# EAGLE schematic interconnect_RA_V1.2 (EAGLE 9.3.0)
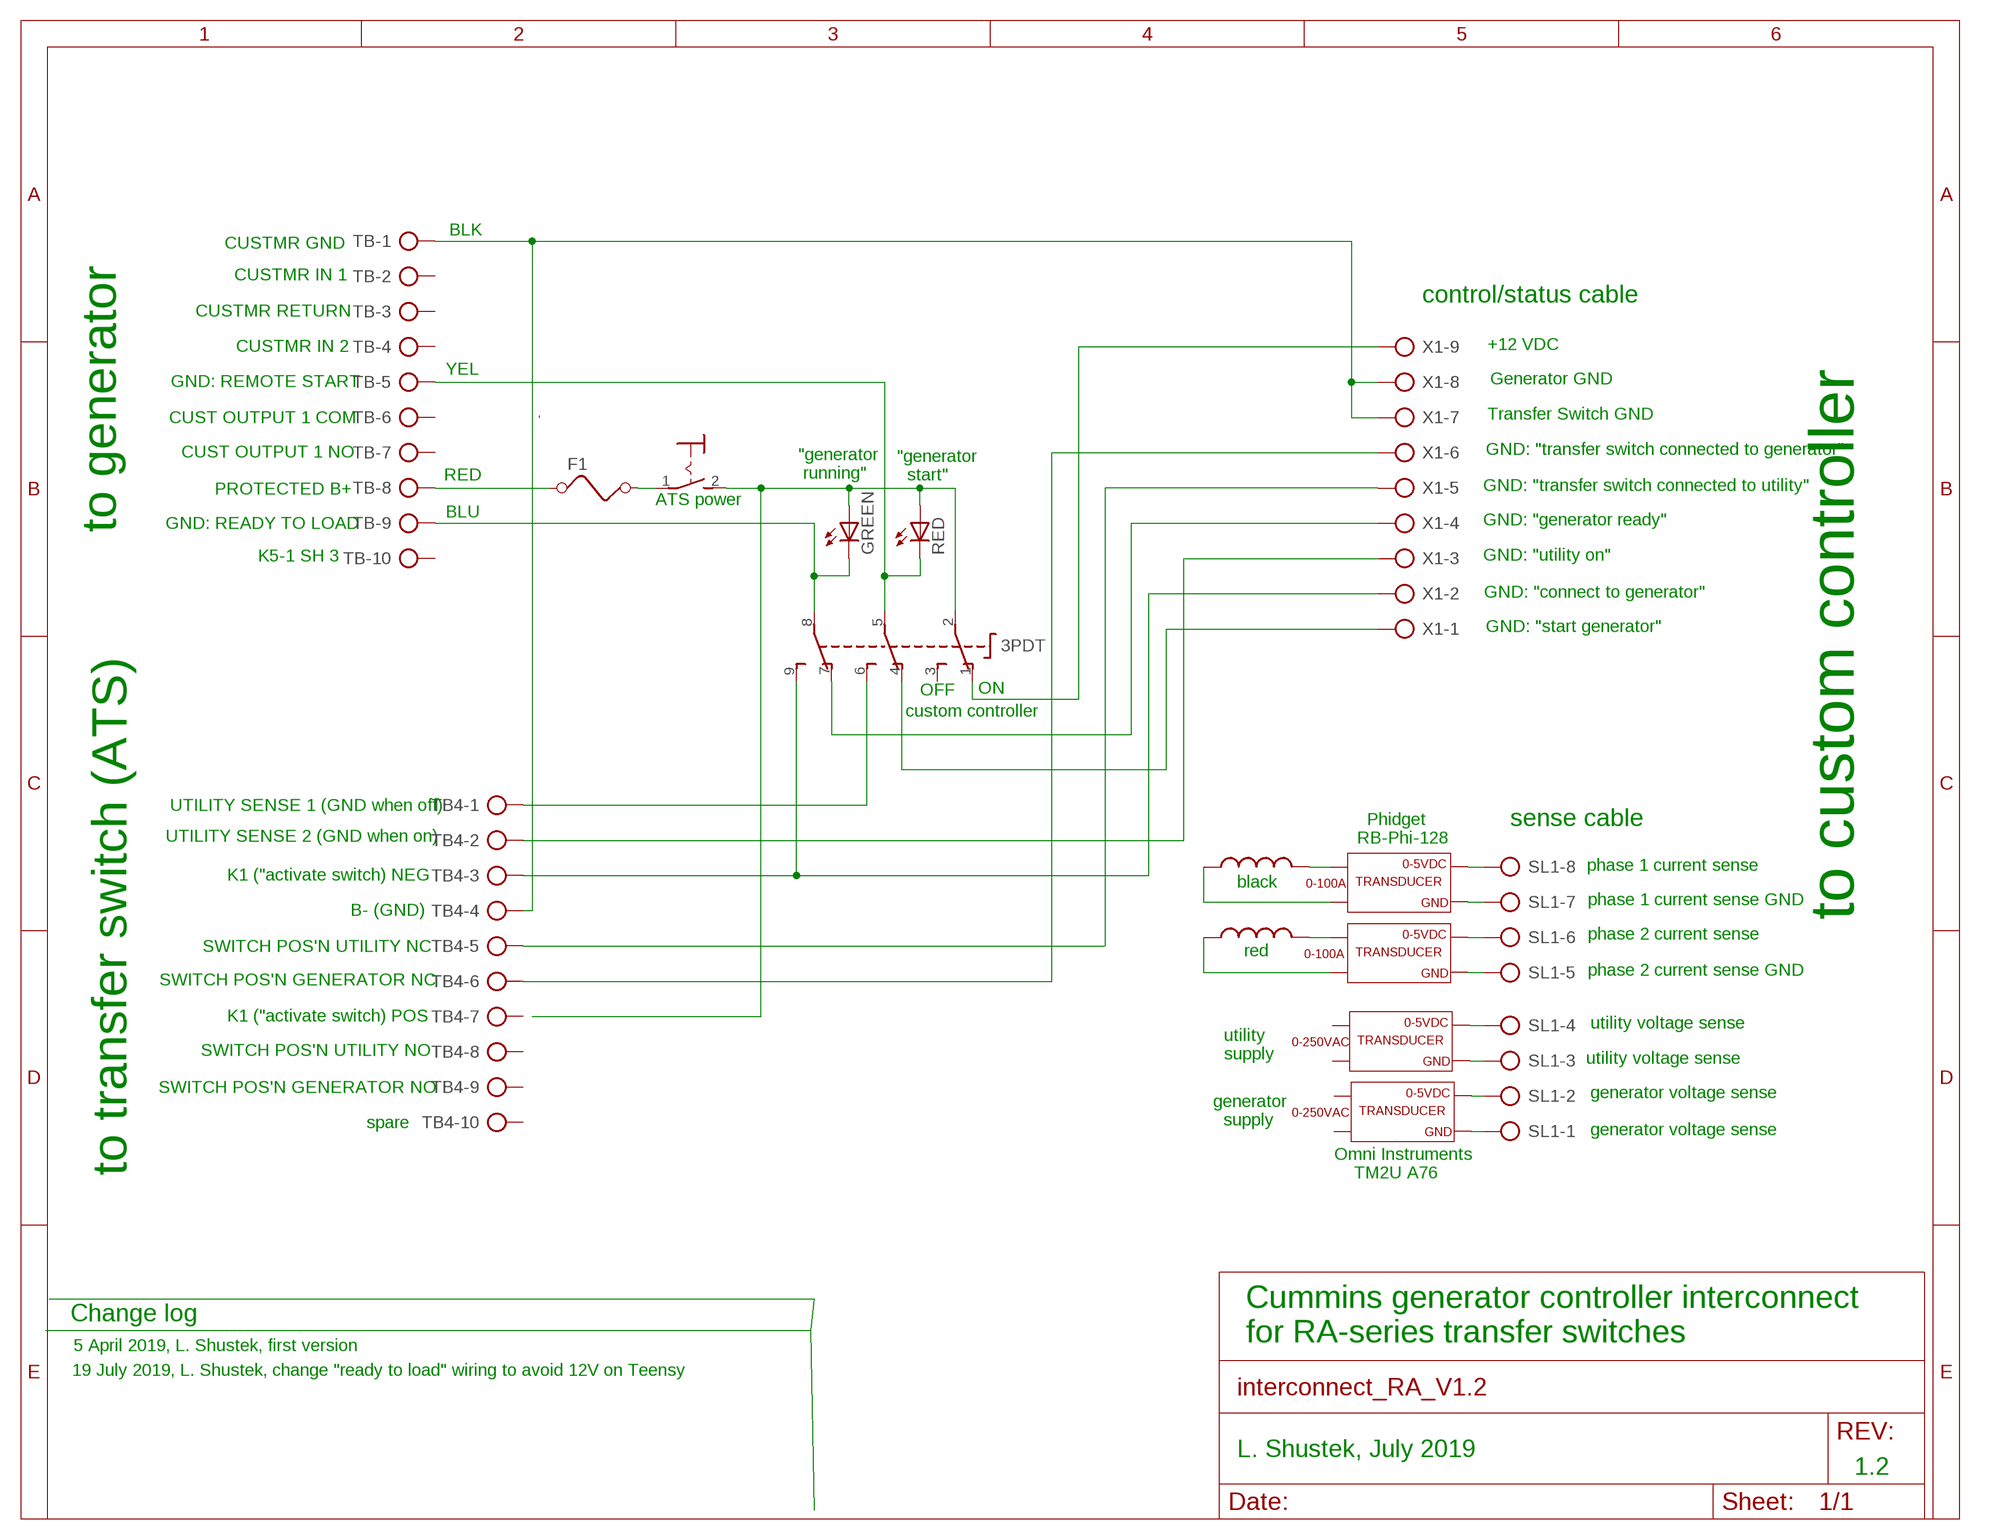
[diagram p0: schematic, sheet 1]

## Parts
F1  FUSE  [FUSE]
GREEN  LED  [SMARTLED-TTW]
L1  L-US0204/5  [0204/5]
L2  L-US0204/5  [0204/5]
RED  LED  [SMARTLED-TTW]
S1  MS243  [MS243]
S2  3PDT  [3PDT]
SL1  AK500/8  [AK500/8]
TB  AK500/10  [AK500/10]
TB4  AK500/10  [AK500/10]
U$1  0-100A  TRANSDUCER  [TRANSDUCER]
U$2  0-100A  TRANSDUCER  [TRANSDUCER]
U$3  0-250VAC  TRANSDUCER  [TRANSDUCER]
U$4  0-250VAC  TRANSDUCER  [TRANSDUCER]
X1  AK500/9  [AK500/9]

## Nets
N$1: TB4.4 TB.1 X1.7 X1.8
N$2: SL1.8 U$1.P$3
N$3: SL1.7 U$1.P$4
N$4: SL1.6 U$2.P$3
N$5: SL1.5 U$2.P$4
N$6: SL1.4 U$3.P$3
N$7: SL1.3 U$3.P$4
N$8: SL1.2 U$4.P$3
N$9: SL1.1 U$4.P$4
N$10: GREEN.A@1(A) RED.A@1(A) S1.2(S) S2.2(P1)
N$11: RED.C@1(C) S2.5(P2) TB.5
N$12: TB4.2 X1.3
N$13: GREEN.C@1(C) S2.8(P3) TB.9
N$14: S2.9(S3) TB4.3 X1.2
N$15: S2.7(O3) X1.4
N$16: S2.4(O2) X1.1
N$17: TB4.6 X1.6
N$18: TB4.5 X1.5
N$19: S2.1(O1) X1.9
N$20: S2.6(S2) TB4.1
N$21: L1.2 U$1.P$1
N$22: L1.1 U$1.P$2
N$23: L2.1 U$2.P$2
N$24: L2.2 U$2.P$1
N$27: F1.1 TB.8
N$28: F1.2 S1.1(P)
Unconnected: S2.3(S1) TB4.7 TB4.8 TB4.9 TB4.10 TB.2 TB.3 TB.4 TB.6 TB.7 TB.10 U$3.P$1 U$3.P$2 U$4.P$1 U$4.P$2

## Notes on the sheet
- BLK
- CUSTMR GND
- CUSTMR IN 1
- control/status cable
- CUSTMR RETURN
- CUSTMR IN 2 | +12 VDC
- YEL
- GND: REMOTE START | Generator GND
- CUST OUTPUT 1 COM | Transfer Switch GND
- CUST OUTPUT 1 NO | GND: "transfer switch connected to generator"
- "generator
   running"
- RED
- "generator
    start"
- PROTECTED B+ | GND: "transfer switch connected to utility"
- ATS power
- BLU
- GND: READY TO LOAD | GND: "generator ready"
- to generator
- K5-1 SH 3 | GND: "utility on"
- GND: "connect to generator"
- GND: "start generator"
- OFF | ON
- custom controller
- UTILITY SENSE 1 (GND when off)
- sense cable
- UTILITY SENSE 2 (GND when on)
- Phidget
  RB-Phi-128
- phase 1 current sense
- K1 ("activate switch) NEG
- black
- phase 1 current sense GND
- B- (GND) | to custom controller
- phase 2 current sense
- SWITCH POS'N UTILITY NC | red
- phase 2 current sense GND
- SWITCH POS'N GENERATOR NC
- K1 ("activate switch) POS
- utility voltage sense
- SWITCH POS'N UTILITY NO
- utility
  supply
- utility voltage sense
- SWITCH POS'N GENERATOR NO
- generator voltage sense
- generator
    supply
- spare
- generator voltage sense
- to transfer switch (ATS)
- Omni Instruments
      TM2U A76
- Change log
- Cummins generator controller interconnect
  for RA-series transfer switches
- 5 April 2019, L. Shustek, first version
- 19 July 2019, L. Shustek, change "ready to load" wiring to avoid 12V on Teensy
- L. Shustek, July 2019
- 1.2

## Library data of the parts
F1 = special:FUSE: FUSE 5 x 20 mm
GREEN RED = Len:LED: LED OSRAM: - CHIPLED LG R971, LG N971, LY N971, LG Q971, LY Q971, LO R971, LY R971 LH N974, LH R974 LS Q976, LO Q976, LY Q976 LO Q996 - Hyper CHIPLED LW Q18S LB Q993, LB Q99A, LB R99A - SideLED LS A670, LO A670, LY A670, LG A670, LP A670 LB A673, LV A673, LT A673, LW A673 LH A674 LY A675 LS A676, LA A676, LO A676, LY A676, LW A676 LS A679, LY A679, LG A679 - Hyper Micro SIDELED® LS Y876, LA Y876, LO Y876, LY Y876 LT Y87S - SmartLED LW L88C, LW L88S LB L89C, LB L89S, LG L890 LS L89K, LO L89K, LY L89K LS L896, LA L896, LO L896, LY L896 - TOPLED LS T670, LO T670, LY T670, LG T670, LP T670 LSG T670, LSP T670, LSY T670, LOP T670, LYG T670 LG T671, LOG T671, LSG T671 LB T673, LV T673, LT T673, LW T673 LH T674 LS T676, LA T676, LO T676, LY T676, LB T676, LH T676, LSB T676, LW T676 LB T67C, LV T67C, LT T67C, LS T67K, LO T67K, LY T67K, LW E67C LS E67B, LA E67B, LO E67B, LY E67B, LB E67C, LV E67C, LT E67C LW T67C LS T679, LY T679, LG T679 LS T770, LO T770, LY T770, LG T770, LP T770 LB T773, LV T773, LT T773, LW T773 LH T774 LS E675, LA E675, LY E675, LS T675 LS T776, LA T776, LO T776, LY T776, LB T776 LHGB T686 LT T68C, LB T68C - Hyper Mini TOPLED® LB M676 - Mini TOPLED Santana® LG M470 LS M47K, LO M47K, LY M47K Source: http://www.osram.convergy.de/
L1 L2 = rcl:L-US: INDUCTOR, American symbol; SPICEPREFIX: L
S1 = switch:MS243: TOGGLE SWITCH
S2 = switch:3PDT: 3PDT 9 pin footswitch SF17020F-0302-21R-L Source: 3PDT.jpg
SL1 = con-ptr500:AK500/8: CONNECTOR; OC_FARNELL: unknown; OC_NEWARK: unknown
TB TB4 = con-ptr500:AK500/10: CONNECTOR; OC_FARNELL: unknown; OC_NEWARK: unknown
U$1-U$4 = Len:TRANSDUCER
X1 = con-ptr500:AK500/9: CONNECTOR; OC_FARNELL: unknown; OC_NEWARK: unknown